# Altium project UC3525_Mosfet_Welding_Board.PrjPcb
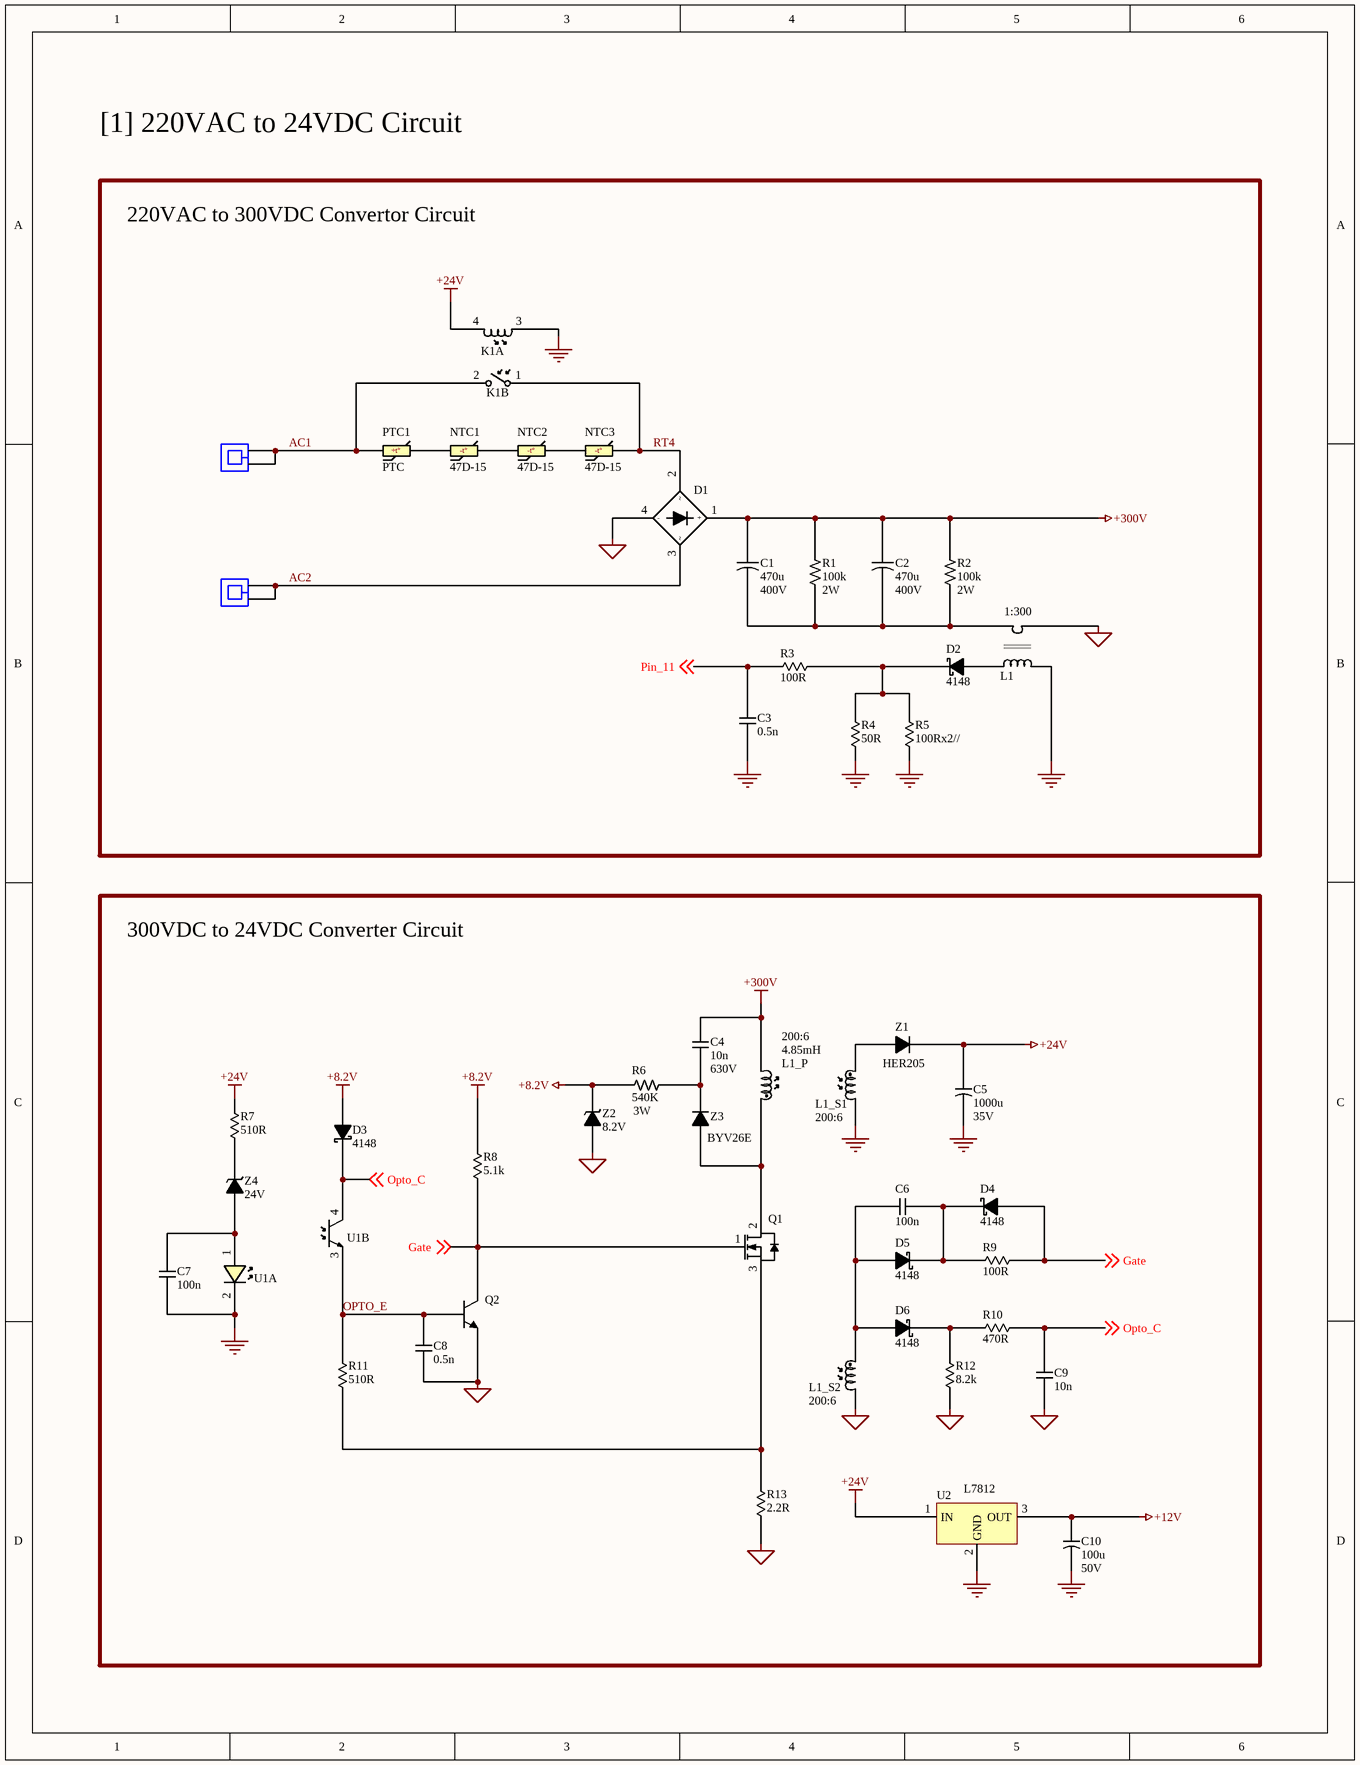
[diagram p0: 220VAC_to_24VDC_Circuit.SchDoc]
3 sheets, 219 parts. Net scope: flat (ports and power ports of the same name join across sheets).
Sheets:
  220VAC_to_24VDC_Circuit.SchDoc
  Control_Circuit.SchDoc
  Full_Bridge_Push_Pull_Circuit.SchDoc

## Sheet 220VAC_to_24VDC_Circuit.SchDoc
size 254 x 330 mm; SheetNumber: 1; SheetTotal: 3

### Parts
C1  470u  Voltage: 400V  [Cap_THD_Polarized_10mm]
C2  470u  Voltage: 400V  [Cap_THD_Polarized_10mm]
C3  0.5n  [Cap_THD_Ceramic_5mm]
C4  10n  Voltage: 630V  [Cap_THD_Film_10mm]
C5  1000u  Voltage: 35V  [Cap_THD_Polarized_5mm]
C6  100n  [Cap_THD_Ceramic_5mm]
C7  100n  [Cap_THD_Ceramic_5mm]
C8  0.5n  [Cap_THD_Ceramic_5mm]
C9  10n  [Cap_THD_Ceramic_5mm]
C10  100u  Voltage: 50V  [Cap_THD_Polarized_5mm]
D1  D  [Bridge_THD]  (value not drawn)
D2  4148  [Diode_THD_7.1mm]
D3  4148  [Diode_THD_7.1mm]
D4  4148  [Diode_THD_7.1mm]
D5  4148  [Diode_THD_7.1mm]
D6  4148  [Diode_THD_7.1mm]
J1  63824-1  [CONN_QC_Faston_5mm]  (value not drawn)
J2  63824-1  [CONN_QC_Faston_5mm]  (value not drawn)
K1  K  [Relay_10mm]  (value not drawn)  (parts A,B of 2)
L1  L  [Current_Transformer]  (value not drawn)
L1_P  4.85mH  [Inductor_THD_5mm]
L1_S1  L  [Inductor_THD_5mm]  (value not drawn)
L1_S2  L  [Inductor_THD_5mm]  (value not drawn)
NTC1  47D-15  [NTC_THD_7.5mm]
NTC2  47D-15  [NTC_THD_7.5mm]
NTC3  47D-15  [NTC_THD_7.5mm]
PTC1  PTC  [PTC_THD_5mm]
Q1  K3878  [TO247]  (value not drawn)
Q2  SS8050  [TO92]  (value not drawn)
R1  100k  Power: 2W  [Res_THD_2W_17.6mm]
R2  100k  Power: 2W  [Res_THD_2W_17.6mm]
R3  100R  [Res_THD_0.25W_10mm]
R4  50R  [Res_THD_0.25W_10mm]
R5  100Rx2//  [Res_THD_0.25W_10mm]
R6  540K  Power: 3W  [Res_THD_2W_17.6mm]
R7  510R  [Res_THD_0.25W_10mm]
R8  5.1k  [Res_THD_0.25W_10mm]
R9  100R  [Res_THD_0.25W_10mm]
R10  470R  [Res_THD_0.25W_10mm]
R11  510R  [Res_THD_0.25W_10mm]
R12  8.2k  [Res_THD_0.25W_10mm]
R13  2.2R  [Res_THD_0.25W_10mm]
U1  U  [DIP4]  (value not drawn)  (parts A,B of 2)
U2  L7812  [TO220_3]
Z1  HER205  [Diode_THD_10.8mm]
Z2  8.2V  [Diode_THD_7.1mm]
Z3  BYV26E  [Diode_THD_10.8mm]
Z4  24V  [Diode_THD_7.1mm]

### Blocks framed on the sheet
220VAC to 300VDC Convertor Circuit: C1-C3 D1 D2 J1 J2 K1 L1 NTC1-NTC3 PTC1 R1-R5
300VDC to 24VDC Converter Circuit: C4-C10 D3-D6 L1_P L1_S1 L1_S2 Q1 Q2 R6-R13 U1 U2 Z1-Z4

### Nets
+8.2V: D3.2(A) R6.3 R8.4 Z2.1(K)
+12V: C10.1(+) U2.3(OUT)
+24V: C5.1(+) K1.4(Coil_2) R7.4 U2.1(IN) Z1.1(K)
+300V: C1.1(+) C2.1(+) C4.2 D1.1(+) L1_P.1 R1.4 R2.4
GND: C3.1 C5.2(-) C7.1 C10.2(-) K1.3(Coil_1) L1.4(S1) L1_S1.2 R4.3 R5.3 U1.2(K) U2.2(GND)
GND_1: C8.1 C9.1 D1.4(-) L1.1(P1) L1_S2.2 Q2.1(E) R12.3 R13.3 Z2.2(A)
AC1: J1.1 J1.2 K1.2(SW_2) PTC1.1
AC2: D1.3 J2.1 J2.2
Gate: D4.2(A) Q1.1(Gate) Q2.3(C) R8.3 R9.3 ; off-sheet Gate
Opto_C: C9.2 D3.1(K) R10.3 U1.4(E) ; off-sheet Opto_C
OPTO_E: C8.2 Q2.2(B) R11.4 U1.3(C)
Pin_11: C3.2 R3.4 ; off-sheet Pin_11
RT4: D1.2 K1.1(SW_1) NTC3.2
NetC1_2: C1.2(-) C2.2(-) L1.2(P2) R1.3 R2.3
NetC4_1: C4.1 R6.4 Z3.1(K)
NetC6_1: C6.1 D4.1(K) D5.1(K) R9.4
NetC6_2: C6.2 D5.2(A) D6.2(A) L1_S2.1
NetC7_2: C7.2 U1.1(A) Z4.2(A)
NetD2_1: D2.1(K) R3.3 R4.4 R5.4
NetD2_2: D2.2(A) L1.3(S2)
NetD6_1: D6.1(K) R10.4 R12.4
NetL1_P_2: L1_P.2 Q1.2(Drain) Z3.2(A)
NetL1_S1_1: L1_S1.1 Z1.2(A)
NetNTC1_1: NTC1.1 PTC1.2
NetNTC1_2: NTC1.2 NTC2.1
NetNTC2_2: NTC2.2 NTC3.1
NetQ1_3: Q1.3(Source) R11.3 R13.4
NetR7_3: R7.3 Z4.1(K)

### Notes on the sheet
- [1] 220VAC to 24VDC Circuit
- (near L1) 1:300
- 200:6
- (near L1_S1) 200:6
- (near L1_S2) 200:6
- (in symbol NTC) -t°
- (in symbol PTC) +t°

### Library data of the parts
C1 C2 = Cap_THD_Polarized_10mm: 10mm THD Polarized Capacitor; Package: Radial
C3 = Cap_THD_Ceramic_5mm: 5mm THD Ceramic Capacitor; Voltage: V
C4 = Cap_THD_Film_10mm
C5 C10 = Cap_THD_Polarized_5mm: 5mm THD Polarized Capacitor; Package: Radial
C6-C9 = Cap_THD_Ceramic_5mm: 5mm THD Ceramic Capacitor
D1 = Bridge_THD_1
D2-D6 = 1N4148: Rectifier Diode Small Signal Switching 100V 0.2A 4ns Automotive 2-Pin DO-35 Ammo; Manufacturer: NXP Semiconductors; Forward Current: 200mA; Capacitance: 4pF; Polarity: Standard; Max Forward Surge Current (Ifsm): 4A; Element Configuration: Single; Supplier 1: Arrow Electronics; Manufacturer Part Number: 1N4148; RoHS: Yes; Category: Uncategorized; Case/Package: SOD; Number of Pins: 2; Max Operating Temperature: 200°C; Packaging: Ammo Pack; Reverse Recovery Time: 4ns; Max Repetitive Reverse Voltage (Vrrm): 100V; Current Rating: 200mA; Voltage Rating (DC): 100V; Output Current: 200mA; Current: 4A; Voltage: 100V; RoHS Compliant: Yes; Lead Free: Lead Free; Reach SVHC Compliant: No; ComponentLink1URL: https://datasheet.ciiva.com/1179/1720485-1179297.pdf?src-supplier=Element14; ComponentLink1Description: https://datasheet.ciiva.com/1179/1720485-1179297.pdf?src-supplier=Element14; ComponentLink2URL: https://datasheet.ciiva.com/26921/getdatasheetpartid-764103-26921186.pdf?src-supplier=Verical; ComponentLink2Description: https://datasheet.ciiva.com/26921/getdatasheetpartid-764103-26921186.pdf?src-supplier=Verical; Supplier Part Number 1: 1N4148
J1 J2 = CONN_QC_Faston: Quick Connect Terminal; Manufacturer: TE Connectivity; Body Material: Brass; Plating: Tin; Gender: Male; Insulation: Non-Insulated; Tab Width: 6.35mm; Tab Thickness: 0.83mm; Mating Tab Width: 0.25inch; Hole Diameter: 0.055inch; PCB Thickness: 0.062inch; Supplier 1: Arrow Electronics; Manufacturer Part Number: 63824-1; RoHS: Yes; Category: Terminals; Stock 1: 23665; Pricing 1: 1=0.0808, 10=0.0729, 25=0.053, 100=0.0524, 250=0.0519, 500=0.0514, 1000=0.0509, 3000=0.0504, 6000=0.0448, 15000=0.0426 (USD); Mount: Through Hole; Contact Material: Brass; Contact Plating: Tin; Color: Silver; Material: Brass; Body Plating: Tin; Terminal Material: Brass; Min Operating Temperature: -30°C; Max Operating Temperature: 110°C; Package Quantity: 10000; Packaging: Tape and Reel; Termination: Tab; Orientation: Straight; Series: Faston; Length: 13.63mm; Height: 14.02mm; Depth: 7.92mm; Size: 0.032inch; Radiation Hardening: No; Lead Free: Lead Free; ELV: Compliant; RoHS Compliant: Yes; Reach SVHC Compliant: Unknown; ComponentLink1URL: https://datasheet.ciiva.com/11721/0900766b80ddd72b-11721738.pdf?src-supplier=Rs; ComponentLink1Description: https://datasheet.ciiva.com/11721/0900766b80ddd72b-11721738.pdf?src-supplier=Rs; ComponentLink2URL: https://datasheet.ciiva.com/839/eng-cd-63824-r-basefilename-839115.pdf?src-supplier=Digi-Key; ComponentLink2Description: https://datasheet.ciiva.com/839/eng-cd-63824-r-basefilename-839115.pdf?src-supplier=Digi-Key; ComponentLink3URL: https://datasheet.ciiva.com/46393/1650963-46393511.pdf?src-supplier=Element14; ComponentLink3Description: https://datasheet.ciiva.com/46393/1650963-46393511.pdf?src-supplier=Element14; ComponentLink4URL: https://datasheet.ciiva.com/7873/1650963-7873563.pdf?src-supplier=Element14; ComponentLink4Description: https://datasheet.ciiva.com/7873/1650963-7873563.pdf?src-supplier=Element14; ComponentLink5URL: https://datasheet.ciiva.com/3144/eng-cs-82004-faston-pcb-tabs-receptacles-0914-3144076.pdf?src-supplier=Avnet; ComponentLink5Description: https://datasheet.ciiva.com/3144/eng-cs-82004-faston-pcb-tabs-receptacles-0914-3144076.pdf?src-supplier=Avnet; Supplier Part Number 1: 63824-1
K1 = Relay
L1 = Transformer Current
L1_P = Inductor TX: TX Coupled Inductor
L1_S1 L1_S2 = Inductor RX: RX Coupled Inductor
NTC1-NTC3 = NTC
Q1 = 2SK3878: Trans MOSFET N-CH Si 900V 9A 3Pin TO-3PN; Fall Time: 20ns; Gate to Source Voltage (Vgs): 30V; Input Capacitance: 2.2nF; Continuous Drain Current (Id): 9A; Drain to Source Voltage (Vdss): 900V; Package: TO-3PN
Q2 = SS8050: Bipolar Transistor BJT NPN Epitaxial Silicon 25V 1500mA 100MHz 1W TO-92-3; Manufacturer: ON Semiconductor / Fairchild; Manufacturer Part Number: SS8050DTA; Max Collector Current: 1.5A; Collector-emitter Voltage-Max: 500mV; hFE Min: 85; Collector Base Voltage (VCBO): 40V; Emitter Base Voltage (VEBO): 6V; Supplier 1: Future Electronics; RoHS: Yes; Category: BJTs; Stock 1: 10000; Pricing 1: 2000=0.0536, 6000=0.0516, 20000=0.0496, 40000=0.0484, 80000=0.0463 (USD); Mount: Through Hole; Case/Package: TO-92-3; Number of Pins: 3; Weight: 0.24g; Min Operating Temperature: -65°C; Max Operating Temperature: 150°C; Packaging: Ammo Pack; Series: -; Package Quantity: 2000; Max Power Dissipation: 1W; Transition Frequency: 100MHz; Collector Emitter Breakdown Voltage: 25V; Polarity: NPN; Collector Emitter Saturation Voltage: 500mV; Gain Bandwidth Product: 100MHz; Voltage Rating (DC): 25V; Collector Emitter Voltage (VCEO): 25V; Max Breakdown Voltage: 25V; Current Rating: 1.5A; Length: 4.58mm; Width: 3.86mm; Height: 4.58mm; Radiation Hardening: No; RoHS Compliant: Yes; Lead Free: Lead Free; Reach SVHC Compliant: No; ComponentLink1URL: https://datasheet.ciiva.com/4721/ss8050-117753-4721333.pdf?src-supplier=Mouser; ComponentLink1Description: https://datasheet.ciiva.com/4721/ss8050-117753-4721333.pdf?src-supplier=Mouser; ComponentLink2URL: https://datasheet.ciiva.com/11207/ss8050-11207512.pdf?src-supplier=Avnet; ComponentLink2Description: https://datasheet.ciiva.com/11207/ss8050-11207512.pdf?src-supplier=Avnet; ComponentLink3URL: https://datasheet.ciiva.com/18648/ss8050-18648133.pdf?src-supplier=Digi-Key; ComponentLink3Description: https://datasheet.ciiva.com/18648/ss8050-18648133.pdf?src-supplier=Digi-Key; ComponentLink4URL: https://datasheet.ciiva.com/17447/ss8050-17447834.pdf?src-supplier=Future+Electronics; ComponentLink4Description: https://datasheet.ciiva.com/17447/ss8050-17447834.pdf?src-supplier=Future+Electronics; ComponentLink5URL: https://datasheet.ciiva.com/46415/1868828-46415608.pdf?src-supplier=Element14; ComponentLink5Description: https://datasheet.ciiva.com/46415/1868828-46415608.pdf?src-supplier=Element14; Supplier Part Number 1: 7178421
R1 R2 R6 = Res_THD_2W: 500mW THD Resistor
R3-R5 = Res_THD_0.25W: 250mW THD Resistor; Power Rating: 0.25W
R7-R13 = Res_THD_0.25W: 250mW THD Resistor; Power Rating: 250mW; Package: Axial
U1 = PC817
Z1 Z3 = Diode_THD_FRD: 10mm Axial Fast Recovery Diode
Z2 Z4 = Diode_THD_Zener: 10mm Axial Zener Diode

## Sheet Control_Circuit.SchDoc
size 330 x 355 mm; SheetNumber: 2; SheetTotal: 3
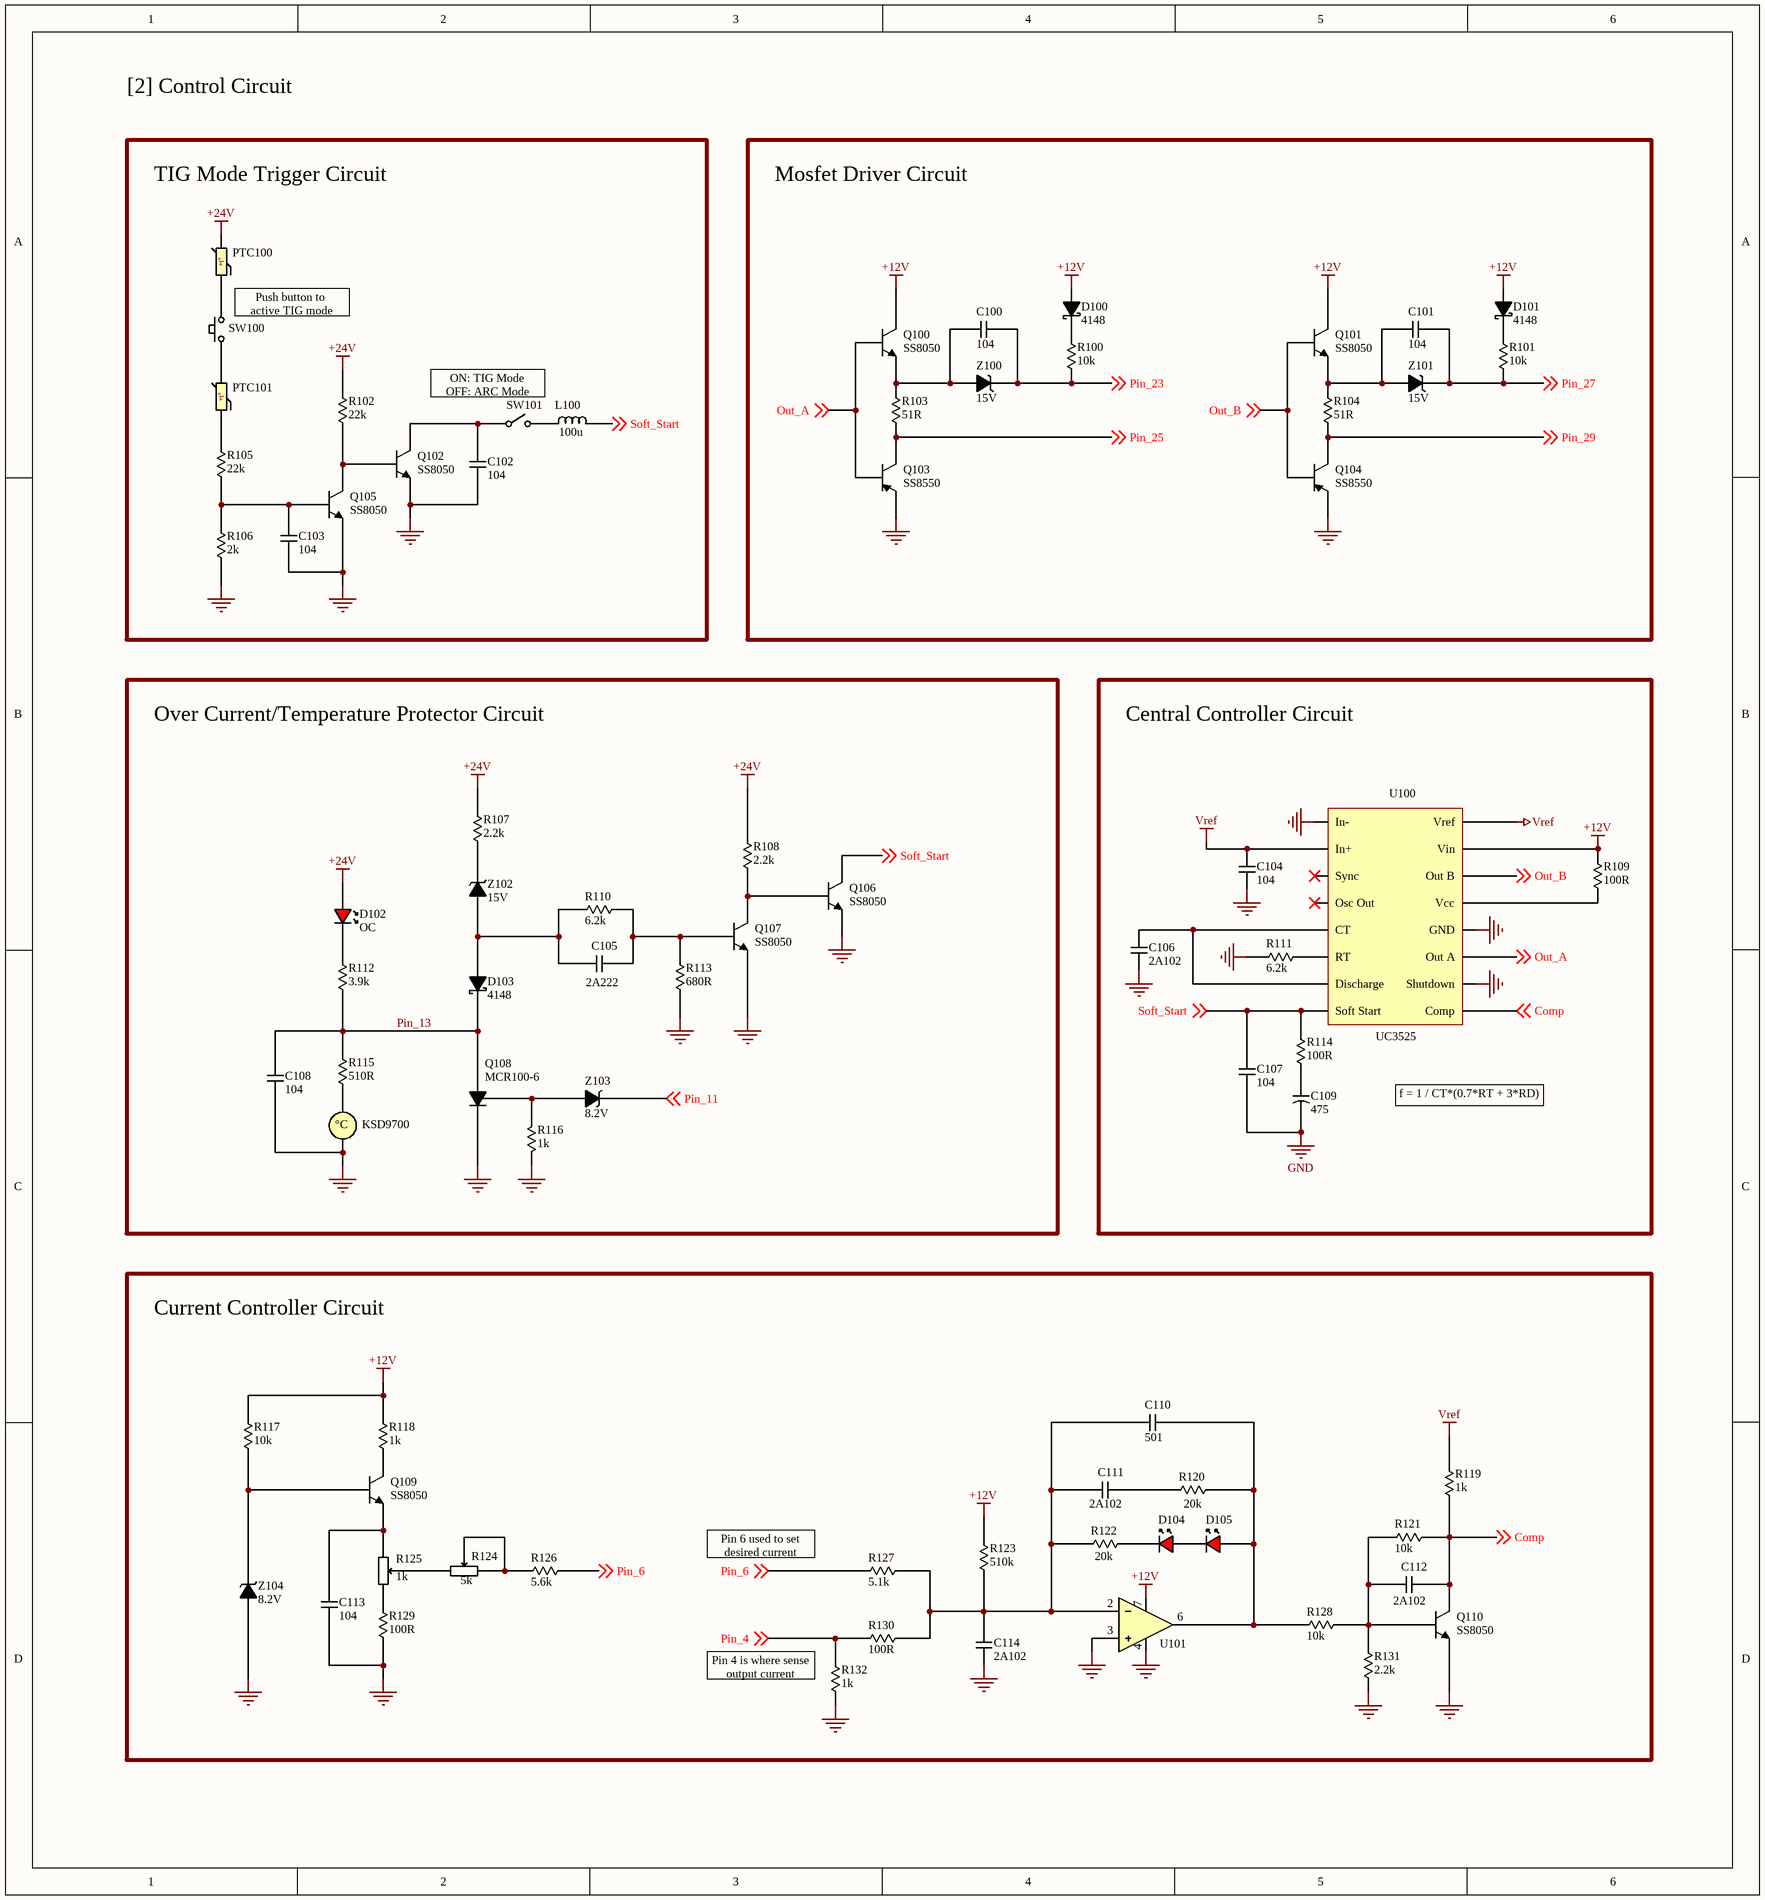
[diagram p1: Control_Circuit.SchDoc]

### Parts
C100  104  [Cap_THD_Ceramic_5mm]
C101  104  [Cap_THD_Ceramic_5mm]
C102  104  [Cap_THD_Ceramic_5mm]
C103  104  [Cap_THD_Ceramic_5mm]
C104  104  [Cap_THD_Ceramic_5mm]
C105  2A222  [Cap_THD_Ceramic_5mm]
C106  2A102  [Cap_THD_Ceramic_5mm]
C107  104  [Cap_THD_Ceramic_5mm]
C108  104  [Cap_THD_Ceramic_5mm]
C109  475  [Cap_THD_Tantalum_2.5mm]
C110  501  [Cap_THD_Ceramic_5mm]
C111  2A102  [Cap_THD_Ceramic_5mm]
C112  2A102  [Cap_THD_Ceramic_5mm]
C113  104  [Cap_THD_Ceramic_5mm]
C114  2A102  [Cap_THD_Ceramic_5mm]
D100  4148  [Diode_THD_7.1mm]
D101  4148  [Diode_THD_7.1mm]
D102  OC  [Led_SMD_0805]
D103  4148  [Diode_THD_7.1mm]
D104  D  [Led_SMD_0805]  (value not drawn)
D105  D  [Led_SMD_0805]  (value not drawn)
L100  100u  [Inductor_THD_5mm]
PTC100  PTC  [PTC_THD_5mm]  (value not drawn)
PTC101  PTC  [PTC_THD_5mm]  (value not drawn)
Q100  SS8050  [TO92]
Q101  SS8050  [TO92]
Q102  SS8050  [TO92]
Q103  SS8550  [TO92]
Q104  SS8550  [TO92]
Q105  SS8050  [TO92]
Q106  SS8050  [TO92]
Q107  SS8050  [TO92]
Q108  MCR100-6  [TO92 - 2.54mm]
Q109  SS8050  [TO92]
Q110  SS8050  [TO92]
R100  10k  [Res_THD_0.25W_10mm]
R101  10k  [Res_THD_0.25W_10mm]
R102  22k  [Res_THD_0.25W_10mm]
R103  51R  [Res_THD_0.25W_10mm]
R104  51R  [Res_THD_0.25W_10mm]
R105  22k  [Res_THD_0.25W_10mm]
R106  2k  [Res_THD_0.25W_10mm]
R107  2.2k  [Res_THD_0.25W_10mm]
R108  2.2k  [Res_THD_0.25W_10mm]
R109  100R  [Res_THD_0.25W_10mm]
R110  6.2k  [Res_THD_0.25W_10mm]
R111  6.2k  [Res_THD_0.25W_10mm]
R112  3.9k  [Res_THD_0.25W_10mm]
R113  680R  [Res_THD_0.25W_10mm]
R114  100R  [Res_THD_0.25W_10mm]
R115  510R  [Res_THD_0.25W_10mm]
R116  1k  [Res_THD_0.25W_10mm]
R117  10k  [Res_THD_0.25W_10mm]
R118  1k  [Res_THD_0.25W_10mm]
R119  1k  [Res_THD_0.25W_10mm]
R120  20k  [Res_THD_0.25W_10mm]
R121  10k  [Res_THD_0.25W_10mm]
R122  20k  [Res_THD_0.25W_10mm]
R123  510k  [Res_THD_0.25W_10mm]
R124  5k  [Trimmer_2.54mm]
R125  1k  [Trimmer_2.54mm]
R126  5.6k  [Res_THD_0.25W_10mm]
R127  5.1k  [Res_THD_0.25W_10mm]
R128  10k  [Res_THD_0.25W_10mm]
R129  100R  [Res_THD_0.25W_10mm]
R130  100R  [Res_THD_0.25W_10mm]
R131  2.2k  [Res_THD_0.25W_10mm]
R132  1k  [Res_THD_0.25W_10mm]
RL100  KSD9700  [CONN_XH_2P_2.5mm]
SW100  SW  [Button_2PIN]  (value not drawn)
SW101  SW  [Button_2PIN]  (value not drawn)
U100  UC3525  [DIP16]
U101  CA3140  [DIP8]  (value not drawn)
Z100  15V  [Diode_THD_7.1mm]
Z101  15V  [Diode_THD_7.1mm]
Z102  15V  [Diode_THD_7.1mm]
Z103  8.2V  [Diode_THD_7.1mm]
Z104  8.2V  [Diode_THD_7.1mm]

### Blocks framed on the sheet
TIG Mode Trigger Circuit: C102 C103 L100 PTC100 PTC101 Q102 Q105 R102 R105 R106 SW100 SW101
Mosfet Driver Circuit: C100 C101 D100 D101 Q100 Q101 Q103 Q104 R100 R101 R103 R104 Z100 Z101
Over Current/Temperature Protector Circuit: C105 C108 D102 D103 Q106-Q108 R107 R108 R110 R112 R113 R115 R116 RL100 Z102 Z103
Central Controller Circuit: C104 C106 C107 C109 R109 R111 R114 U100
Current Controller Circuit: C110-C114 D104 D105 Q109 Q110 R117-R132 U101 Z104

### Nets
+12V: D100.2(A) D101.2(A) Q100.3(C) Q101.3(C) R109.3 R117.3 R118.3 R123.4 U100.15(Vin) U101.7(V+)
+24V: D102.2(A) PTC100.2 R102.3 R107.3 R108.4
GND: C102.1 C103.1 C104.1 C106.1 C107.2 C108.1 C109.2(-) C113.1 C114.2 Q102.1(E) Q103.1(E) Q104.1(E) Q105.1(E) Q106.1(E) Q107.1(E) Q108.2(K) Q110.1(E) R106.4 R111.4 R113.3 R116.4 R129.4 R131.3 R132.4 RL100.2 U100.1(In-) U100.10(Shutdown) U100.12(GND) U101.3(In+) U101.4(V-) Z104.2(A)
Vref: C104.2 R119.4 U100.2(In+) U100.16(Vref)
Comp: C112.1 Q110.3(C) R119.3 R121.4 U100.9(Comp) ; off-sheet Comp
Out_A: Q100.2(B) Q103.2(B) U100.11(Out_A) ; off-sheet Out_A
Out_B: Q101.2(B) Q104.2(B) U100.14(Out_B) ; off-sheet Out_B
Pin_4: R130.4 R132.3 ; off-sheet Pin_4
Pin_6: R126.4 R127.4 ; off-sheet Pin_6
Pin_11: Z103.1(K) ; off-sheet Pin_11
Pin_13: C108.2 D103.1(K) Q108.1(A) R112.4 R115.3
Pin_23: C100.2 R100.4 Z100.1(K) ; off-sheet Pin_23
Pin_25: Q103.3(C) R103.4 ; off-sheet Pin_25
Pin_27: C101.2 R101.4 Z101.1(K) ; off-sheet Pin_27
Pin_29: Q104.3(C) R104.4 ; off-sheet Pin_29
Soft_Start: C107.1 L100.2 Q106.3(C) R114.4 U100.8(Soft_Start) ; off-sheet Soft_Start
NetC100_1: C100.1 Q100.1(E) R103.3 Z100.2(A)
NetC101_1: C101.1 Q101.1(E) R104.3 Z101.2(A)
NetC102_2: C102.2 Q102.3(C) SW101.1
NetC103_2: C103.2 Q105.2(B) R105.4 R106.3
NetC105_1: C105.1 Q107.2(B) R110.4 R113.4
NetC105_2: C105.2 D103.2(A) R110.3 Z102.2(A)
NetC106_2: C106.2 U100.5(CT) U100.7(Discharge)
NetC109_1: C109.1(+) R114.3
NetC110_1: C110.1 D105.2(A) R120.4 R128.3 U101.6(Out)
NetC110_2: C110.2 C111.2 C114.1 R122.3 R123.3 R127.3 R130.3 U101.2(In-)
NetC111_1: C111.1 R120.3
NetC112_2: C112.2 Q110.2(B) R121.3 R128.4 R131.4
NetC113_2: C113.2 Q109.1(E) R125.1
NetD100_1: D100.1(K) R100.3
NetD101_1: D101.1(K) R101.3
NetD102_1: D102.1(K) R112.3
NetD104_1: D104.1(K) R122.4
NetD104_2: D104.2(A) D105.1(K)
NetL100_1: L100.1 SW101.2
NetPTC100_1: PTC100.1 SW100.2
NetPTC101_1: PTC101.1 R105.3
NetPTC101_2: PTC101.2 SW100.1
NetQ102_2: Q102.2(B) Q105.3(C) R102.4
NetQ106_2: Q106.2(B) Q107.3(C) R108.3
NetQ108_3: Q108.3(G) R116.3 Z103.2(A)
NetQ109_2: Q109.2(B) R117.4 Z104.1(K)
NetQ109_3: Q109.3(C) R118.4
NetR107_4: R107.4 Z102.1(K)
NetR109_4: R109.4 U100.13(Vcc)
NetR111_3: R111.3 U100.6(RT)
NetR115_4: R115.4 RL100.1
NetR124_1: R124.1 R125.2
NetR124_2: R124.2 R124.3 R126.3
NetR125_3: R125.3 R129.3

Not connected (* = marked no-connect by the designer): U100 3(Sync)* 4(Osc_Out)*

### Notes on the sheet
- [2] Control Circuit
- Push button to
  active TIG mode
- ON: TIG Mode
  OFF: ARC Mode
- f = 1 / CT*(0.7*RT + 3*RD)
- Pin 6 used to set desired current
- (near R132) Pin 4 is where sense output current
- (in symbol PTC) +t°
- (in symbol Relay_KSD9700) °C

### Library data of the parts
C100-C108 C110-C114 = Cap_THD_Ceramic_5mm: 5mm THD Ceramic Capacitor; Voltage: V
C109 = Cap_THD_Tantalum_2.5mm: Voltage: V
D100 D101 D103 = 1N4148: as D2 on sheet 220VAC_to_24VDC_Circuit; Supplier 1: Arrow Electronics; Manufacturer Part Number: 1N4148; RoHS: Yes; Category: Uncategorized; Case/Package: SOD; Number of Pins: 2; Max Operating Temperature: 200°C; Packaging: Ammo Pack; Reverse Recovery Time: 4ns; Max Repetitive Reverse Voltage (Vrrm): 100V; Current Rating: 200mA; Voltage Rating (DC): 100V; Output Current: 200mA; Current: 4A; Voltage: 100V; RoHS Compliant: Yes; Lead Free: Lead Free; Reach SVHC Compliant: No; ComponentLink1URL: https://datasheet.ciiva.com/1179/1720485-1179297.pdf?src-supplier=Element14; ComponentLink1Description: https://datasheet.ciiva.com/1179/1720485-1179297.pdf?src-supplier=Element14; ComponentLink2URL: https://datasheet.ciiva.com/26921/getdatasheetpartid-764103-26921186.pdf?src-supplier=Verical; ComponentLink2Description: https://datasheet.ciiva.com/26921/getdatasheetpartid-764103-26921186.pdf?src-supplier=Verical; Supplier Part Number 1: 1N4148
D102 D104 D105 = LED Red
L100 = Inductor: Generic Inductor
Q100-Q102 Q105-Q107 Q109 Q110 = SS8050: as Q2 on sheet 220VAC_to_24VDC_Circuit; Supplier 1: Future Electronics; RoHS: Yes; Category: BJTs; Stock 1: 10000; Pricing 1: 2000=0.0536, 6000=0.0516, 20000=0.0496, 40000=0.0484, 80000=0.0463 (USD); Mount: Through Hole; Case/Package: TO-92-3; Number of Pins: 3; Weight: 0.24g; Min Operating Temperature: -65°C; Max Operating Temperature: 150°C; Packaging: Ammo Pack; Series: -; Package Quantity: 2000; Max Power Dissipation: 1W; Transition Frequency: 100MHz; Collector Emitter Breakdown Voltage: 25V; Polarity: NPN; Collector Emitter Saturation Voltage: 500mV; Gain Bandwidth Product: 100MHz; Voltage Rating (DC): 25V; Collector Emitter Voltage (VCEO): 25V; Max Breakdown Voltage: 25V; Current Rating: 1.5A; Length: 4.58mm; Width: 3.86mm; Height: 4.58mm; Radiation Hardening: No; RoHS Compliant: Yes; Lead Free: Lead Free; Reach SVHC Compliant: No; ComponentLink1URL: https://datasheet.ciiva.com/4721/ss8050-117753-4721333.pdf?src-supplier=Mouser; ComponentLink1Description: https://datasheet.ciiva.com/4721/ss8050-117753-4721333.pdf?src-supplier=Mouser; ComponentLink2URL: https://datasheet.ciiva.com/11207/ss8050-11207512.pdf?src-supplier=Avnet; ComponentLink2Description: https://datasheet.ciiva.com/11207/ss8050-11207512.pdf?src-supplier=Avnet; ComponentLink3URL: https://datasheet.ciiva.com/18648/ss8050-18648133.pdf?src-supplier=Digi-Key; ComponentLink3Description: https://datasheet.ciiva.com/18648/ss8050-18648133.pdf?src-supplier=Digi-Key; ComponentLink4URL: https://datasheet.ciiva.com/17447/ss8050-17447834.pdf?src-supplier=Future+Electronics; ComponentLink4Description: https://datasheet.ciiva.com/17447/ss8050-17447834.pdf?src-supplier=Future+Electronics; ComponentLink5URL: https://datasheet.ciiva.com/46415/1868828-46415608.pdf?src-supplier=Element14; ComponentLink5Description: https://datasheet.ciiva.com/46415/1868828-46415608.pdf?src-supplier=Element14; Supplier Part Number 1: 7178421
Q103 Q104 = SS8550: Bipolar Transistor BJT PNP Epitaxial Silicon 25V 1500mA 200MHz 1W TO-92-3; Manufacturer: ON Semiconductor / Fairchild; Manufacturer Part Number: SS8550DTA; hFE Min: 85; Max Collector Current: 1.5A; Collector Base Voltage (VCBO): -40V; Emitter Base Voltage (VEBO): -6V; Collector Emitter Saturation Voltage: -280mV; Voltage Rating (DC): -25V; Collector-emitter Voltage-Max: 500mV; Current Rating: -1.5A; Number of Elements: 1; Supplier 1: Arrow Electronics; RoHS: Yes; Category: BJTs; Stock 1: 13550; Pricing 1: 1=0.3913, 10=0.2848, 25=0.282, 100=0.1142, 250=0.1131, 500=0.1081, 1000=0.0671, 3000=0.0643, 6000=0.0553 (USD); Mount: Through Hole; Case/Package: TO-92-3; Number of Pins: 3; Weight: 0.24g; Min Operating Temperature: -65°C; Max Operating Temperature: 150°C; Series: -; Packaging: Ammo Pack; Polarity: PNP; Package Quantity: 2000; Max Power Dissipation: 1W; Transition Frequency: 200MHz; Collector Emitter Breakdown Voltage: 25V; Gain Bandwidth Product: 200MHz; Collector Emitter Voltage (VCEO): 25V; Frequency: 200MHz; Max Breakdown Voltage: 25V; Power Dissipation: 1W; Max Frequency: 200MHz; Radiation Hardening: No; Lead Free: Lead Free; RoHS Compliant: Yes; Reach SVHC Compliant: No; ComponentLink1URL: https://datasheet.ciiva.com/25625/0900766b80f9b5d4-25625990.pdf?src-supplier=Rs; ComponentLink1Description: https://datasheet.ciiva.com/25625/0900766b80f9b5d4-25625990.pdf?src-supplier=Rs; ComponentLink2URL: https://datasheet.ciiva.com/4721/ss8550-118608-4721282.pdf?src-supplier=Mouser; ComponentLink2Description: https://datasheet.ciiva.com/4721/ss8550-118608-4721282.pdf?src-supplier=Mouser; ComponentLink3URL: https://datasheet.ciiva.com/46415/1869982-46415611.pdf?src-supplier=Element14; ComponentLink3Description: https://datasheet.ciiva.com/46415/1869982-46415611.pdf?src-supplier=Element14; Supplier Part Number 1: SS8550DTA
Q108 = SCR_MCR100_6_V1: Thyristor SCR 400V 10A 3-Pin TO-92 Tape and Ammo; Manufacturer: ON Semiconductor; Manufacturer Part Number: MCR100-6ZL1G; Hold Current: 5mA; Current Rating: 800mA; Supplier 1: Avnet; RoHS: Yes; Category: SCRs; Stock 1: 1846; Case/Package: TO-92-3; Number of Pins: 3; Min Operating Temperature: -40°C; Max Operating Temperature: 110°C; Voltage Rating (DC): 400V; Packaging: Tape and Reel; Series: -; Package Quantity: 2000; RMS Current (Irms): 800mA; Max Repetitive Reverse Voltage (Vrrm): 400V; Radiation Hardening: No; RoHS Compliant: Yes; Lead Free: Lead Free; ComponentLink1URL: https://datasheet.ciiva.com/3054/mcr100-d-3054696.pdf?src-supplier=Avnet; ComponentLink1Description: https://datasheet.ciiva.com/3054/mcr100-d-3054696.pdf?src-supplier=Avnet; ComponentLink2URL: https://datasheet.ciiva.com/6366/mcr100-d-6366847.pdf?src-supplier=Digi-Key; ComponentLink2Description: https://datasheet.ciiva.com/6366/mcr100-d-6366847.pdf?src-supplier=Digi-Key; ComponentLink3URL: https://datasheet.ciiva.com/16453/mcr100-d-16453261.pdf?src-supplier=Future+Electronics; ComponentLink3Description: https://datasheet.ciiva.com/16453/mcr100-d-16453261.pdf?src-supplier=Future+Electronics; Supplier Part Number 1: MCR100-6ZL1G
R100-R123 R126-R132 = Res_THD_0.25W: 250mW THD Resistor; Power Rating: 0.25W
R124 R125 = Trimmer
RL100 = Relay_KSD9700: KSD-9700 series thermal protector
SW100 = Switch Button
SW101 = Switch Toggle
U101 = CA3140: CA140 Series 4.5 MHz 9 V/us 36 V BiMOS Operational Amplifier - PDIP-8; Manufacturer: Renesas; Manufacturer Part Number: CA3140EZ; Supplier 1: Mouser; RoHS: Yes; Category: Amplifiers - Op Amps, Buffer, Instrumentation; Stock 1: 16980; Pricing 1: 1=3.29, 10=2.95, 50=2.95, 100=2.42, 1000=1.73, 10000=1.58 (USD); ComponentLink1URL: https://www.renesas.com/en-us/www/doc/datasheet/ca3140-a.pdf?src-supplier=Digi-Key; ComponentLink1Description: https://www.renesas.com/en-us/www/doc/datasheet/ca3140-a.pdf?src-supplier=Digi-Key; Supplier Part Number 1: 968-CA3140EZ
Z100-Z104 = Diode_THD_Zener: 10mm Axial Zener Diode

## Sheet Full_Bridge_Push_Pull_Circuit.SchDoc
size A3; SheetNumber: 3; SheetTotal: 3
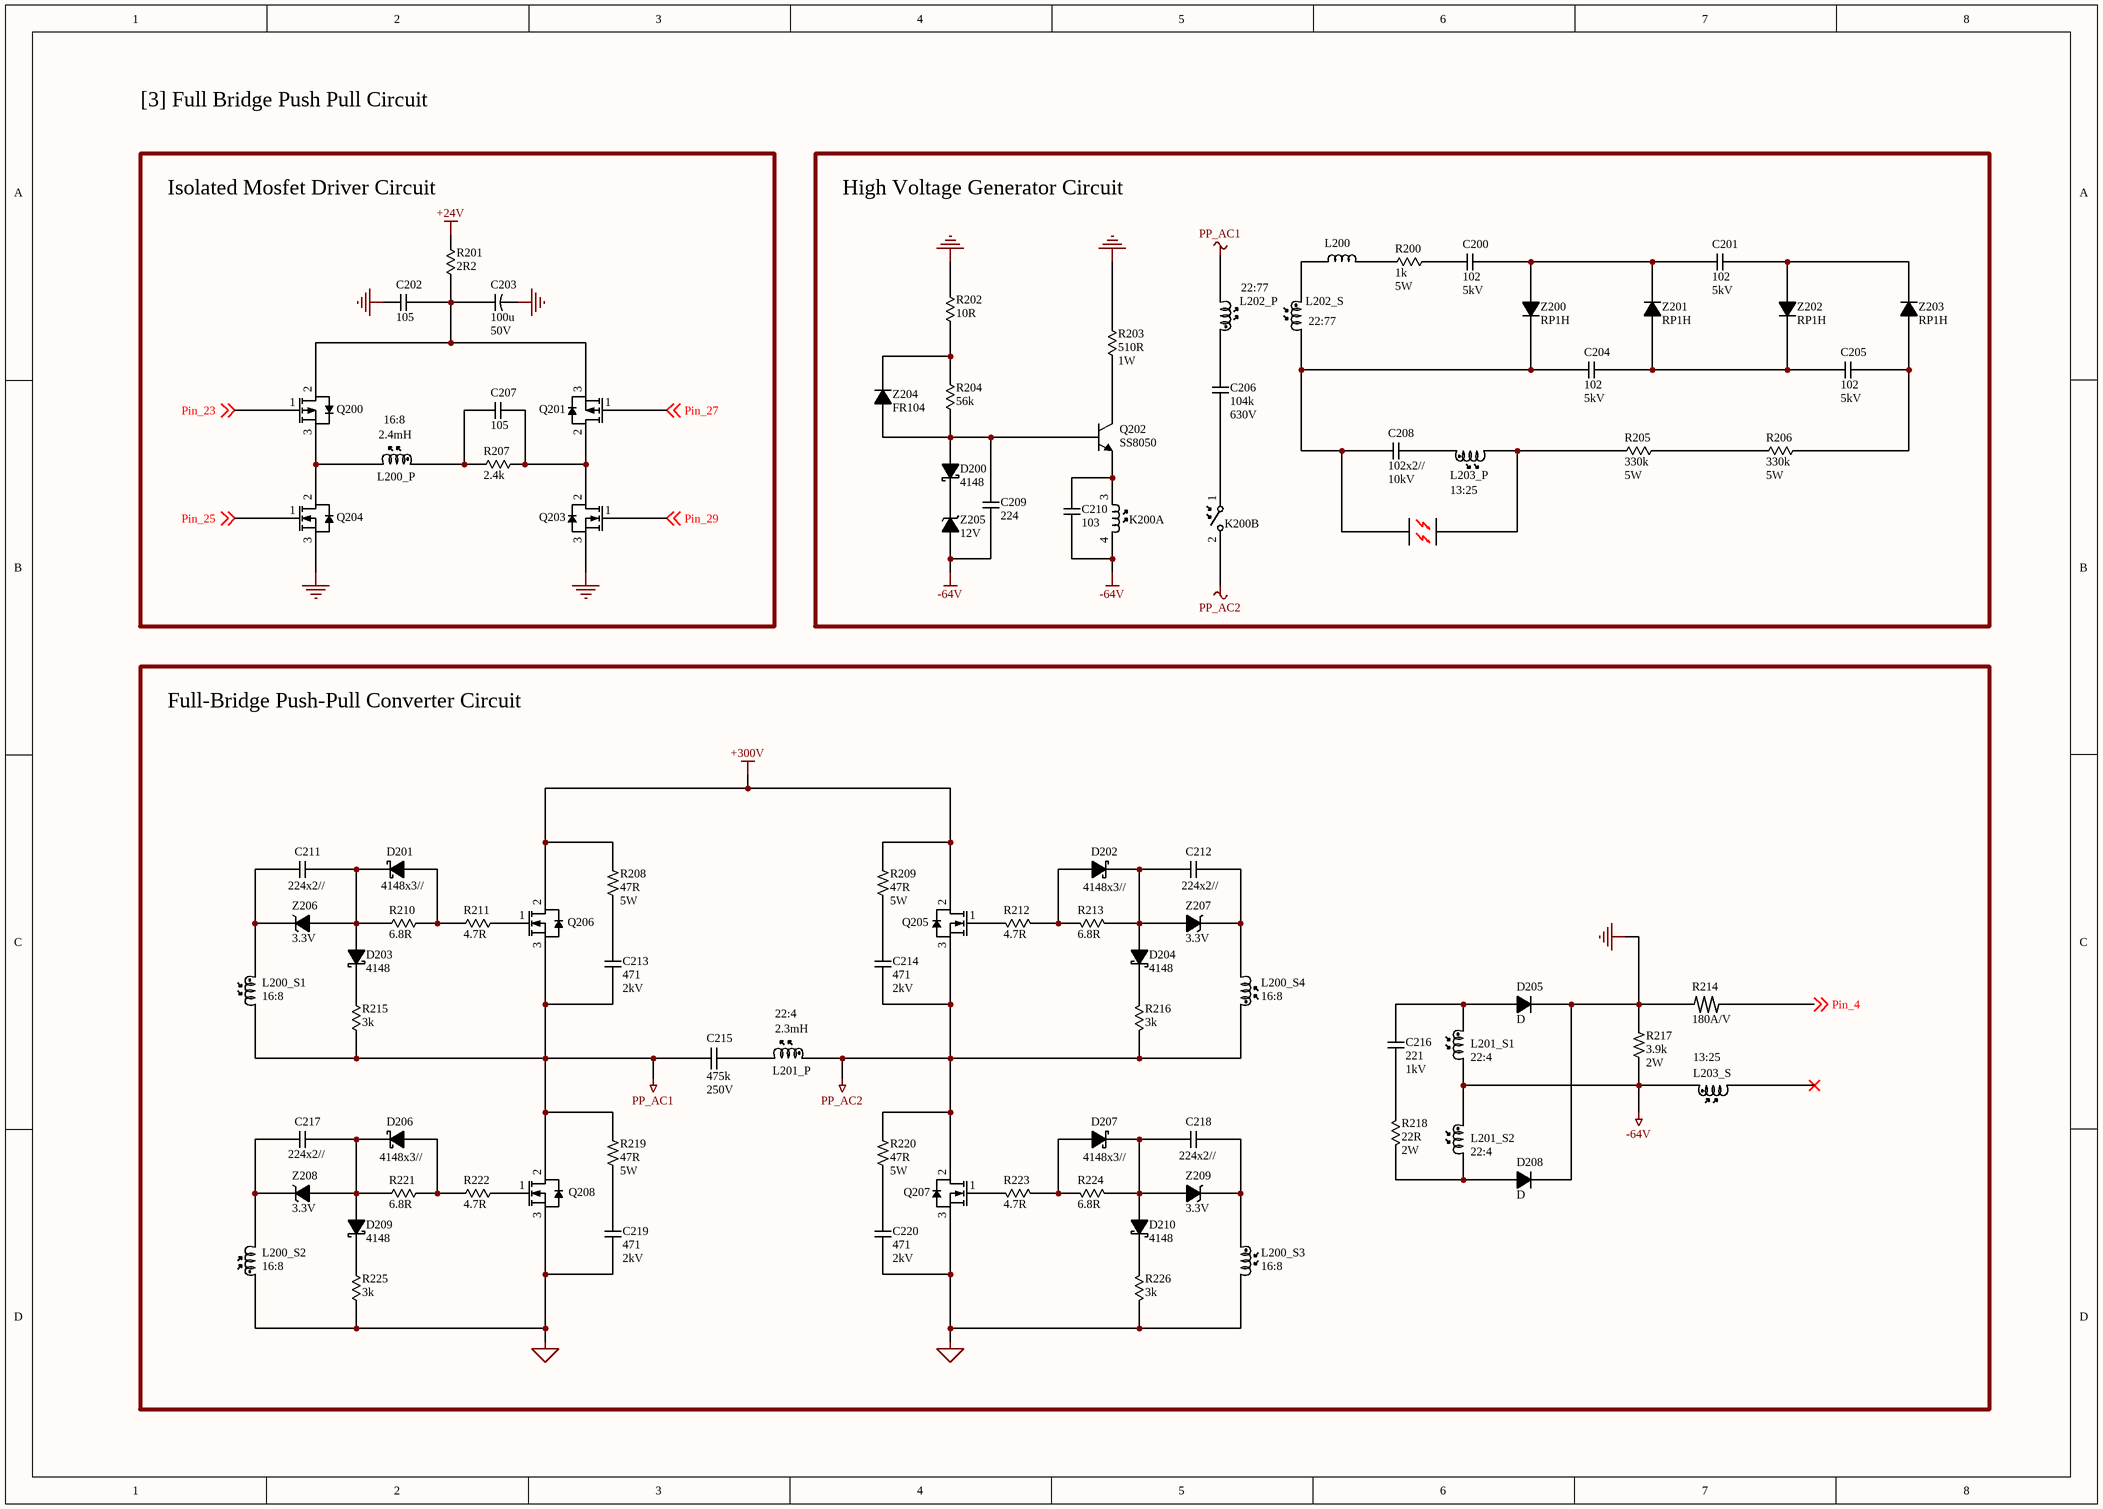
[diagram p2: Full_Bridge_Push_Pull_Circuit.SchDoc]

### Parts
C200  102  Voltage: 5kV  [Cap_THD_HVCeramic_5mm]
C201  102  Voltage: 5kV  [Cap_THD_HVCeramic_5mm]
C202  105  [Cap_THD_Ceramic_5mm]
C203  100u  Voltage: 50V  [Cap_THD_Polarized_5mm]
C204  102  Voltage: 5kV  [Cap_THD_HVCeramic_5mm]
C205  102  Voltage: 5kV  [Cap_THD_HVCeramic_5mm]
C206  104k  Voltage: 630V  [Cap_THD_Film_10mm]
C207  105  [Cap_THD_Ceramic_5mm]
C208  102x2//  Voltage: 10kV  [Cap_THD_HVCeramic_5mm]
C209  224  [Cap_THD_Ceramic_5mm]
C210  103  [Cap_THD_Ceramic_5mm]
C211  224x2//  [Cap_THD_Ceramic_5mm]
C212  224x2//  [Cap_THD_Ceramic_5mm]
C213  471  Voltage: 2kV  [Cap_THD_HVCeramic_5mm]
C214  471  Voltage: 2kV  [Cap_THD_HVCeramic_5mm]
C215  475k  Voltage: 250V  [Cap_THD_Film_22.5mm]
C216  221  Voltage: 1kV  [Cap_THD_Ceramic_5mm]
C217  224x2//  [Cap_THD_Ceramic_5mm]
C218  224x2//  [Cap_THD_Ceramic_5mm]
C219  471  Voltage: 2kV  [Cap_THD_HVCeramic_5mm]
C220  471  Voltage: 2kV  [Cap_THD_HVCeramic_5mm]
D200  4148  [Diode_THD_7.1mm]
D201  4148x3//  [Diode_THD_7.1mm]
D202  4148x3//  [Diode_THD_7.1mm]
D203  4148  [Diode_THD_7.1mm]
D204  4148  [Diode_THD_7.1mm]
D205  D  [Diode_THD_10.8mm]
D206  4148x3//  [Diode_THD_7.1mm]
D207  4148x3//  [Diode_THD_7.1mm]
D208  D  [Diode_THD_10.8mm]
D209  4148  [Diode_THD_7.1mm]
D210  4148  [Diode_THD_7.1mm]
K200  K  [Relay_10mm]  (value not drawn)  (parts A,B of 2)
K201  Spark_Gap  (value not drawn)
L200  L  [Inductor_THD_5mm]  (value not drawn)
L200_P  2.4mH  [Inductor_THD_5mm]
L200_S1  L  [Inductor_THD_5mm]  (value not drawn)
L200_S2  L  [Inductor_THD_5mm]  (value not drawn)
L200_S3  L  [Inductor_THD_5mm]  (value not drawn)
L200_S4  L  [Inductor_THD_5mm]  (value not drawn)
L201_P  2.3mH  [Inductor_THD_5mm]
L201_S1  L  [Inductor_THD_5mm]  (value not drawn)
L201_S2  L  [Inductor_THD_5mm]  (value not drawn)
L202_P  L  [Inductor_THD_5mm]  (value not drawn)
L202_S  L  [Inductor_THD_5mm]  (value not drawn)
L203_P  L  [Inductor_THD_5mm]  (value not drawn)
L203_S  L  [Inductor_THD_5mm]  (value not drawn)
Q200  IRF9Z24N  [TO220_3]  (value not drawn)
Q201  IRF9Z24N  [TO220_3]  (value not drawn)
Q202  SS8050  [TO92]
Q203  IRFZ24N  [TO220_3]  (value not drawn)
Q204  IRFZ24N  [TO220_3]  (value not drawn)
Q205  IRFP460  [TO247]  (value not drawn)
Q206  IRFP460  [TO247]  (value not drawn)
Q207  IRFP460  [TO247]  (value not drawn)
Q208  IRFP460  [TO247]  (value not drawn)
R200  1k  Power Rating: 5W  [Res_THD_0.25W_10mm]
R201  2R2  [Res_THD_0.25W_10mm]
R202  10R  [Res_THD_0.25W_10mm]
R203  510R  Power Rating: 1W  [Res_THD_0.25W_10mm]
R204  56k  [Res_THD_0.25W_10mm]
R205  330k  Power Rating: 5W  [Res_THD_0.25W_10mm]
R206  330k  Power Rating: 5W  [Res_THD_0.25W_10mm]
R207  2.4k  [Res_THD_0.25W_10mm]
R208  47R  Power Rating: 5W  [Res_THD_2W_17.6mm]
R209  47R  Power Rating: 5W  [Res_THD_2W_17.6mm]
R210  6.8R  [Res_THD_0.25W_10mm]
R211  4.7R  [Res_THD_0.25W_10mm]
R212  4.7R  [Res_THD_0.25W_10mm]
R213  6.8R  [Res_THD_0.25W_10mm]
R214  180A/V  [Res_THD_2W_17.6mm]
R215  3k  [Res_THD_0.25W_10mm]
R216  3k  [Res_THD_0.25W_10mm]
R217  3.9k  Power Rating: 2W  [Res_THD_2W_17.6mm]
R218  22R  Power Rating: 2W  [Res_THD_0.25W_10mm]
R219  47R  Power Rating: 5W  [Res_THD_2W_17.6mm]
R220  47R  Power Rating: 5W  [Res_THD_2W_17.6mm]
R221  6.8R  [Res_THD_0.25W_10mm]
R222  4.7R  [Res_THD_0.25W_10mm]
R223  4.7R  [Res_THD_0.25W_10mm]
R224  6.8R  [Res_THD_0.25W_10mm]
R225  3k  [Res_THD_0.25W_10mm]
R226  3k  [Res_THD_0.25W_10mm]
Z200  RP1H  [Diode_THD_10.8mm]
Z201  RP1H  [Diode_THD_10.8mm]
Z202  RP1H  [Diode_THD_10.8mm]
Z203  RP1H  [Diode_THD_10.8mm]
Z204  FR104  [Diode_THD_10.8mm]
Z205  12V  [Diode_THD_7.1mm]
Z206  3.3V  [Diode_THD_7.1mm]
Z207  3.3V  [Diode_THD_7.1mm]
Z208  3.3V  [Diode_THD_7.1mm]
Z209  3.3V  [Diode_THD_7.1mm]

### Blocks framed on the sheet
Isolated Mosfet Driver Circuit: C202 C203 C207 L200_P Q200 Q201 Q203 Q204 R201 R207
High Voltage Generator Circuit: C200 C201 C204-C206 C208-C210 D200 K200 K201 L200 L202_P L202_S L203_P Q202 R200 R202-R206 Z200-Z205
Full-Bridge Push-Pull Converter Circuit: C211-C220 D201-D210 L200_S1-L200_S4 L201_P L201_S1 L201_S2 L203_S Q205-Q208 R208-R226 Z206-Z209

### Nets
+24V: R201.4
+300V: Q205.2(Drain) Q206.2(Drain) R208.4 R209.4
-64V: C209.1 C210.1 K200.4(Coil_2) L201_S1.2 L201_S2.1 L203_S.1 R217.3 Z205.2(A)
GND: C202.1 C203.2(-) D205.1(K) D208.1(K) Q203.3(Source) Q204.3(Source) R202.4 R203.4 R214.3 R217.4
GND_1: C219.1 C220.1 L200_S2.1 L200_S3.2 Q207.3(Source) Q208.3(Source) R225.3 R226.3
PP_AC1: C213.1 C215.1 L200_S1.2 L202_P.1 Q206.3(Source) Q208.2(Drain) R215.3 R219.4
PP_AC2: C214.1 K200.2(SW_2) L200_S4.1 L201_P.2 Q205.3(Source) Q207.2(Drain) R216.3 R220.4
Pin_4: R214.4 ; off-sheet Pin_4
Pin_23: Q200.1(Gate) ; off-sheet Pin_23
Pin_25: Q204.1(Gate) ; off-sheet Pin_25
Pin_27: Q201.1(Gate) ; off-sheet Pin_27
Pin_29: Q203.1(Gate) ; off-sheet Pin_29
NetC200_1: C200.1 R200.3
NetC200_2: C200.2 C201.1 Z200.2(A) Z201.1(K)
NetC201_2: C201.2 Z202.2(A) Z203.1(K)
NetC202_2: C202.2 C203.1(+) Q200.2(Drain) Q201.3(Source) R201.3
NetC204_1: C204.1 C208.1 K201.1 L202_S.2 Z200.1(K)
NetC204_2: C204.2 C205.1 Z201.2(A) Z202.1(K)
NetC205_2: C205.2 R206.3 Z203.2(A)
NetC206_1: C206.1 K200.1(SW_1)
NetC206_2: C206.2 L202_P.2
NetC207_1: C207.1 L200_P.2 R207.3
NetC207_2: C207.2 Q201.2(Drain) Q203.2(Drain) R207.4
NetC208_2: C208.2 L203_P.2
NetC209_2: C209.2 D200.2(A) Q202.2(B) R204.3 Z204.2(A)
NetC210_2: C210.2 K200.3(Coil_1) Q202.1(E)
NetC211_1: C211.1 L200_S1.1 Z206.1(K)
NetC211_2: C211.2 D201.1(K) D203.2(A) R210.4 Z206.2(A)
NetC212_1: C212.1 L200_S4.2 Z207.1(K)
NetC212_2: C212.2 D202.1(K) D204.2(A) R213.4 Z207.2(A)
NetC213_2: C213.2 R208.3
NetC214_2: C214.2 R209.3
NetC215_2: C215.2 L201_P.1
NetC216_1: C216.1 D205.2(A) L201_S1.1
NetC216_2: C216.2 R218.4
NetC217_1: C217.1 L200_S2.2 Z208.1(K)
NetC217_2: C217.2 D206.1(K) D209.2(A) R221.4 Z208.2(A)
NetC218_1: C218.1 L200_S3.1 Z209.1(K)
NetC218_2: C218.2 D207.1(K) D210.2(A) R224.4 Z209.2(A)
NetC219_2: C219.2 R219.3
NetC220_2: C220.2 R220.3
NetD200_1: D200.1(K) Z205.1(K)
NetD201_2: D201.2(A) R210.3 R211.4
NetD202_2: D202.2(A) R212.4 R213.3
NetD203_1: D203.1(K) R215.4
NetD204_1: D204.1(K) R216.4
NetD206_2: D206.2(A) R221.3 R222.4
NetD207_2: D207.2(A) R223.4 R224.3
NetD208_2: D208.2(A) L201_S2.2 R218.3
NetD209_1: D209.1(K) R225.4
NetD210_1: D210.1(K) R226.4
NetK201_2: K201.2 L203_P.1 R205.4
NetL200_1: L200.1 L202_S.1
NetL200_2: L200.2 R200.4
NetL200_P_1: L200_P.1 Q200.3(Source) Q204.2(Drain)
NetQ202_3: Q202.3(C) R203.3
NetQ205_1: Q205.1(Gate) R212.3
NetQ206_1: Q206.1(Gate) R211.3
NetQ207_1: Q207.1(Gate) R223.3
NetQ208_1: Q208.1(Gate) R222.3
NetR202_3: R202.3 R204.4 Z204.1(K)
NetR205_3: R205.3 R206.4

Not connected (* = marked no-connect by the designer): L203_S 2*

### Notes on the sheet
- [3] Full Bridge Push Pull Circuit
- 22:77
- (near L202_S) 22:77
- (near L200_P) 16:8
- 13:25
- (near L200_S1) 16:8
- (near L201_P) 22:4
- (near L200_S4) 16:8
- (near L201_S1) 22:4
- (near L203_S) 13:25
- (near L201_S2) 22:4
- (near L200_S2) 16:8
- (near L200_S3) 16:8

### Library data of the parts
C200 C201 C204 C205 C208 C213 C214 C219 C220 = Cap_THD_HVCeramic_5mm: 5mm THD Ceramic High Voltage Capacitor
C202 C207 C209-C212 C217 C218 = Cap_THD_Ceramic_5mm: 5mm THD Ceramic Capacitor; Voltage: V
C203 = Cap_THD_Polarized_5mm: 5mm THD Polarized Capacitor
C206 = Cap_THD_Film_10mm
C215 = Cap_THD_Film_22.5mm
C216 = Cap_THD_Ceramic_5mm: 5mm THD Ceramic Capacitor
D200-D204 D206 D207 D209 D210 = 1N4148: as D2 on sheet 220VAC_to_24VDC_Circuit; Supplier 1: Arrow Electronics; Manufacturer Part Number: 1N4148; RoHS: Yes; Category: Uncategorized; Case/Package: SOD; Number of Pins: 2; Max Operating Temperature: 200°C; Packaging: Ammo Pack; Reverse Recovery Time: 4ns; Max Repetitive Reverse Voltage (Vrrm): 100V; Current Rating: 200mA; Voltage Rating (DC): 100V; Output Current: 200mA; Current: 4A; Voltage: 100V; RoHS Compliant: Yes; Lead Free: Lead Free; Reach SVHC Compliant: No; ComponentLink1URL: https://datasheet.ciiva.com/1179/1720485-1179297.pdf?src-supplier=Element14; ComponentLink1Description: https://datasheet.ciiva.com/1179/1720485-1179297.pdf?src-supplier=Element14; ComponentLink2URL: https://datasheet.ciiva.com/26921/getdatasheetpartid-764103-26921186.pdf?src-supplier=Verical; ComponentLink2Description: https://datasheet.ciiva.com/26921/getdatasheetpartid-764103-26921186.pdf?src-supplier=Verical; Supplier Part Number 1: 1N4148
D205 D208 = Diode_THD_Rectifier: 10mm Axial Rectifier Diode
K200 = Relay
L200 = Inductor: Generic Inductor
L200_P L201_P L202_P L203_P = Inductor TX: TX Coupled Inductor
L200_S1-L200_S4 L201_S1 L201_S2 L202_S L203_S = Inductor RX: RX Coupled Inductor
Q200 Q201 = IRF9Z24N: Mosfet, Power; P-ch; Vdss -55V; Rds(on) 0.175 Ohm; Id -12A; TO-220AB; Pd 45W; Vgs +/-20V; Manufacturer: International Rectifier; Supplier 1: Allied Electronics; Manufacturer Part Number: IRF9Z24N; RoHS: No; Category: Uncategorized; Number of Pins: 3; RoHS Compliant: No; ComponentLink1URL: https://datasheet.ciiva.com/29326/162549-da-01-en-irf-9-z-24-n-29326126.pdf?src-supplier=Conrad; ComponentLink1Description: https://datasheet.ciiva.com/29326/162549-da-01-en-irf-9-z-24-n-29326126.pdf?src-supplier=Conrad; Supplier Part Number 1: 70017017
Q202 = SS8050: as Q2 on sheet 220VAC_to_24VDC_Circuit; Supplier 1: Future Electronics; RoHS: Yes; Category: BJTs; Stock 1: 10000; Pricing 1: 2000=0.0536, 6000=0.0516, 20000=0.0496, 40000=0.0484, 80000=0.0463 (USD); Mount: Through Hole; Case/Package: TO-92-3; Number of Pins: 3; Weight: 0.24g; Min Operating Temperature: -65°C; Max Operating Temperature: 150°C; Packaging: Ammo Pack; Series: -; Package Quantity: 2000; Max Power Dissipation: 1W; Transition Frequency: 100MHz; Collector Emitter Breakdown Voltage: 25V; Polarity: NPN; Collector Emitter Saturation Voltage: 500mV; Gain Bandwidth Product: 100MHz; Voltage Rating (DC): 25V; Collector Emitter Voltage (VCEO): 25V; Max Breakdown Voltage: 25V; Current Rating: 1.5A; Length: 4.58mm; Width: 3.86mm; Height: 4.58mm; Radiation Hardening: No; RoHS Compliant: Yes; Lead Free: Lead Free; Reach SVHC Compliant: No; ComponentLink1URL: https://datasheet.ciiva.com/4721/ss8050-117753-4721333.pdf?src-supplier=Mouser; ComponentLink1Description: https://datasheet.ciiva.com/4721/ss8050-117753-4721333.pdf?src-supplier=Mouser; ComponentLink2URL: https://datasheet.ciiva.com/11207/ss8050-11207512.pdf?src-supplier=Avnet; ComponentLink2Description: https://datasheet.ciiva.com/11207/ss8050-11207512.pdf?src-supplier=Avnet; ComponentLink3URL: https://datasheet.ciiva.com/18648/ss8050-18648133.pdf?src-supplier=Digi-Key; ComponentLink3Description: https://datasheet.ciiva.com/18648/ss8050-18648133.pdf?src-supplier=Digi-Key; ComponentLink4URL: https://datasheet.ciiva.com/17447/ss8050-17447834.pdf?src-supplier=Future+Electronics; ComponentLink4Description: https://datasheet.ciiva.com/17447/ss8050-17447834.pdf?src-supplier=Future+Electronics; ComponentLink5URL: https://datasheet.ciiva.com/46415/1868828-46415608.pdf?src-supplier=Element14; ComponentLink5Description: https://datasheet.ciiva.com/46415/1868828-46415608.pdf?src-supplier=Element14; Supplier Part Number 1: 7178421
Q203 Q204 = IRFZ24N: Mosfet, Power; N-ch; Vdss 55V; Rds(on) 0.07 Ohm; Id 17A; TO-220AB; Pd 45W; Vgs +/-20V; Manufacturer: International Rectifier; Gate to Source Voltage (Vgs): 20V; Number of Elements: 1; Supplier 1: Allied Electronics; Manufacturer Part Number: IRFZ24N; RoHS: No; Category: Uncategorized; Mount: Through Hole; Case/Package: TO-220AB; Number of Pins: 3; Min Operating Temperature: -55°C; Max Operating Temperature: 175°C; Continuous Drain Current (ID): 17A; Power Dissipation: 45W; RoHS Compliant: No; Supplier Part Number 1: 70017049
Q205-Q208 = IRFP460: MOSFET N-CH 500V 20A TO-247AC; Manufacturer: Vishay; Manufacturer Part Number: IRFP460LCPBF; Rise Time: 77ns; Drain to Source Resistance: 270mR; Gate to Source Voltage (Vgs): 30V; Input Capacitance: 3.6nF; Max Power Dissipation: 280W; Fall Time: 43ns; Polarity: N-CHANNEL; Turn-Off Delay Time: 40ns; Turn-On Delay Time: 18ns; Number of Channels: 1; Threshold Voltage: 4V; Polarization: N; Supplier 1: Mouser; RoHS: Yes; Category: MOSFETs; Stock 1: 2457; Pricing 1: 1=4.66, 10=4.66, 50=4.66, 100=3.82, 1000=2.37, 10000=2.28 (USD); Mount: Through Hole; Case/Package: TO-247-3; Number of Pins: 3; Weight: 1.340411oz; Min Operating Temperature: -55°C; Max Operating Temperature: 150°C; Packaging: Rail/Tube; Continuous Drain Current (ID): 20A; Package Quantity: 500; Rds On Max: 270mR; Drain to Source Voltage (Vdss): 500V; Voltage Rating (DC): 500V; Current Rating: 20A; Drain to Source Breakdown Voltage: 500V; Power Dissipation: 280W; Nominal Vgs: 4V; Drain-source On Resistance-Max: 270mR; Current: 20A; Voltage: 500V; Length: 15.87mm; Width: 5.31mm; Height: 20.7mm; Lead Free: Lead Free; RoHS Compliant: Yes; Reach SVHC Compliant: Unknown; ComponentLink1URL: https://datasheet.ciiva.com/4439/91235-86256-4439273.pdf?src-supplier=Mouser; ComponentLink1Description: https://datasheet.ciiva.com/4439/91235-86256-4439273.pdf?src-supplier=Mouser; ComponentLink2URL: https://datasheet.ciiva.com/22754/1349722-22754579.pdf?src-supplier=Farnell; ComponentLink2Description: https://datasheet.ciiva.com/22754/1349722-22754579.pdf?src-supplier=Farnell; ComponentLink3URL: https://datasheet.ciiva.com/8025/irfp460lc-8025611.pdf?src-supplier=Element14; ComponentLink3Description: https://datasheet.ciiva.com/8025/irfp460lc-8025611.pdf?src-supplier=Element14; ComponentLink4URL: https://datasheet.ciiva.com/6385/91235-6385806.pdf?src-supplier=Digi-Key; ComponentLink4Description: https://datasheet.ciiva.com/6385/91235-6385806.pdf?src-supplier=Digi-Key; ComponentLink5URL: https://datasheet.ciiva.com/16358/91235-16358139.pdf?src-supplier=Future+Electronics; ComponentLink5Description: https://datasheet.ciiva.com/16358/91235-16358139.pdf?src-supplier=Future+Electronics; ComponentLink6URL: https://datasheet.ciiva.com/7643/1349722-7643339.pdf?src-supplier=Element14; ComponentLink6Description: https://datasheet.ciiva.com/7643/1349722-7643339.pdf?src-supplier=Element14; ComponentLink7URL: https://datasheet.ciiva.com/18432/70078943-18432519.pdf?src-supplier=Allied+Electronics; ComponentLink7Description: https://datasheet.ciiva.com/18432/70078943-18432519.pdf?src-supplier=Allied+Electronics; Supplier Part Number 1: 844-IRFP460LCPBF
R200 R203 R205 R206 R218 = Res_THD_0.25W: 250mW THD Resistor
R201 R202 R204 R207 R210-R213 R215 R216 R221-R226 = Res_THD_0.25W: 250mW THD Resistor; Power Rating: 0.25W
R208 R209 R217 R219 R220 = Res_THD_2W: 500mW THD Resistor
R214 = Res_THD_Shunt: 500mW THD Resistor; Power Rating: 2W
Z200-Z204 = Diode_THD_FRD: 10mm Axial Fast Recovery Diode
Z205-Z209 = Diode_THD_Zener: 10mm Axial Zener Diode

## Nets that join several sheets
+12V: 220VAC_to_24VDC_Circuit (C10.1 U2.3), Control_Circuit (10 pins)
+24V: 220VAC_to_24VDC_Circuit (5 pins), Control_Circuit (5 pins), Full_Bridge_Push_Pull_Circuit (R201.4)
+300V: 220VAC_to_24VDC_Circuit (7 pins), Full_Bridge_Push_Pull_Circuit (Q205.2 Q206.2 R208.4 R209.4)
GND: 220VAC_to_24VDC_Circuit (11 pins), Control_Circuit (31 pins), Full_Bridge_Push_Pull_Circuit (10 pins)
GND_1: 220VAC_to_24VDC_Circuit (9 pins), Full_Bridge_Push_Pull_Circuit (8 pins)
Pin_4: Control_Circuit (R130.4 R132.3), Full_Bridge_Push_Pull_Circuit (R214.4)
Pin_11: 220VAC_to_24VDC_Circuit (C3.2 R3.4), Control_Circuit (Z103.1)
Pin_23: Control_Circuit (C100.2 R100.4 Z100.1), Full_Bridge_Push_Pull_Circuit (Q200.1)
Pin_25: Control_Circuit (Q103.3 R103.4), Full_Bridge_Push_Pull_Circuit (Q204.1)
Pin_27: Control_Circuit (C101.2 R101.4 Z101.1), Full_Bridge_Push_Pull_Circuit (Q201.1)
Pin_29: Control_Circuit (Q104.3 R104.4), Full_Bridge_Push_Pull_Circuit (Q203.1)